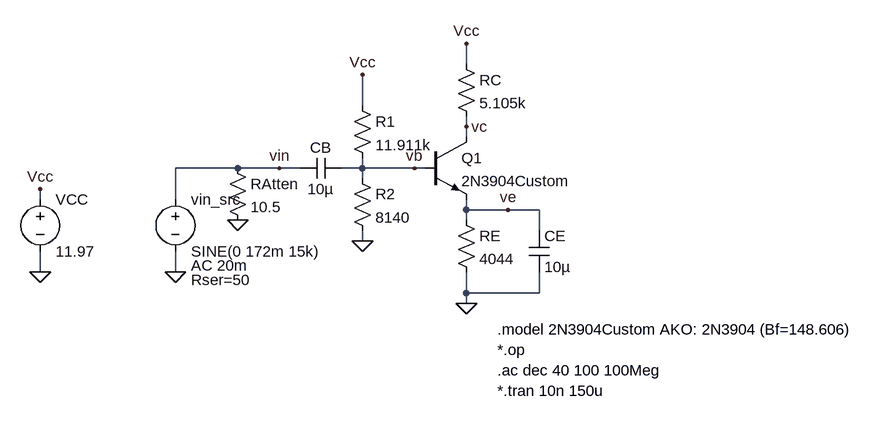
[diagram p0: schematic lab4_real.asc]
lab4_real.asc, the LTspice schematic file:
Version 4
SHEET 1 1144 680
WIRE 528 64 528 32
WIRE 368 128 368 80
WIRE 528 160 528 144
WIRE 528 176 528 160
WIRE 176 224 80 224
WIRE 240 224 176 224
WIRE 272 224 240 224
WIRE 368 224 368 208
WIRE 368 224 336 224
WIRE 448 224 368 224
WIRE 464 224 448 224
WIRE 368 240 368 224
WIRE -128 272 -128 256
WIRE 80 272 80 224
WIRE 528 288 528 272
WIRE 592 288 528 288
WIRE 640 288 592 288
WIRE 528 304 528 288
WIRE 640 320 640 288
WIRE 368 336 368 320
WIRE -128 384 -128 352
WIRE 80 384 80 352
WIRE 528 416 528 384
WIRE 640 416 640 384
WIRE 640 416 528 416
WIRE 528 432 528 416
FLAG 80 384 0
FLAG 528 432 0
FLAG 368 336 0
FLAG -128 384 0
FLAG 240 224 vin
FLAG 592 288 ve
FLAG 448 224 vb
FLAG 528 160 vc
FLAG 176 304 0
FLAG -128 256 Vcc
FLAG 528 32 Vcc
FLAG 368 80 Vcc
SYMBOL Res 352 112 R0
SYMATTR InstName R1
SYMATTR Value 11.911k
SYMBOL Res 352 224 R0
SYMATTR InstName R2
SYMATTR Value 8140
SYMBOL Cap 336 208 R90
WINDOW 0 0 32 VBottom 2
WINDOW 3 32 32 VTop 2
SYMATTR InstName CB
SYMATTR Value 10µ
SYMBOL Res 512 48 R0
SYMATTR InstName RC
SYMATTR Value 5.105k
SYMBOL Res 512 288 R0
SYMATTR InstName RE
SYMATTR Value 4044
SYMBOL Cap 624 320 R0
SYMATTR InstName CE
SYMATTR Value 10µ
SYMBOL Voltage 80 256 R0
WINDOW 123 24 118 Left 2
WINDOW 39 24 140 Left 2
SYMATTR Value2 AC 20m
SYMATTR SpiceLine Rser=50
SYMATTR InstName vin_src
SYMATTR Value SINE(0 172m 15k)
SYMBOL npn 464 176 R0
SYMATTR InstName Q1
SYMATTR Value 2N3904Custom
SYMBOL Voltage -128 256 R0
SYMATTR InstName VCC
SYMATTR Value 11.97
SYMBOL Res 160 208 R0
SYMATTR InstName RAtten
SYMATTR Value 10.5
TEXT 576 472 Left 2 !.model 2N3904Custom AKO: 2N3904 (Bf=148.606)
TEXT 576 504 Left 2 !*.op\n.ac dec 40 100 100Meg\n*.tran 10n 150u

The netlist it stands for:
* lab4_real.asc
R1 Vcc vb 11.911k
R2 vb 0 8140
CB vb vin 10µ
RC Vcc vc 5.105k
RE ve 0 4044
CE ve 0 10µ
vin_src vin 0 SINE(0 172m 15k) AC 20m Rser=50
Q1 vc vb ve 0 2N3904Custom
VCC Vcc 0 11.97
RAtten vin 0 10.5
.model NPN NPN
.model PNP PNP
.lib standard.bjt
.model 2N3904Custom AKO: 2N3904 (Bf=148.606)
*.op
.ac dec 40 100 100Meg
*.tran 10n 150u
.backanno
.end

* Results of the author's LTspice run, read from the files saved beside the schematic
* Operating Point, zero values left out:
*   V(vcc) = 11.97 V
*   V(vb) = 4.827 V
*   V(vc) = 6.739 V
*   V(ve) = 4.171 V
*   Ic(Q1) = 1.025 mA
*   Ib(Q1) = 6.782 µA
*   Ie(Q1) = -1.031 mA
*   I(R1) = 599.7 µA
*   I(R2) = 592.9 µA
*   I(Rc) = 1.025 mA
*   I(Re) = 1.031 mA
*   I(Vcc) = -1.624 mA
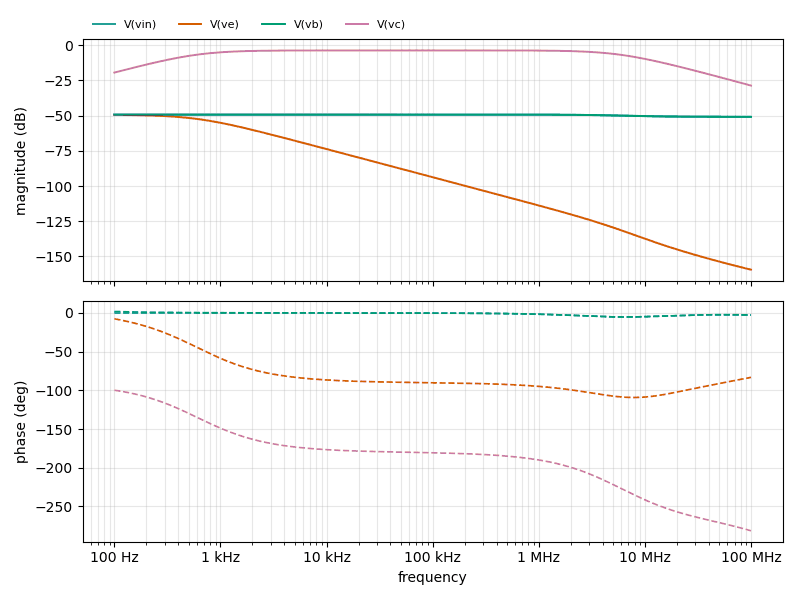
[diagram p1: AC Analysis of lab4_real.asc, plotted from the saved traces]
* AC Analysis, 1 run:
*   V(vin): -49.21 dB at 100 Hz, -50.83 dB at 100 MHz, peak -49.21 dB at 100 Hz
*   V(ve): -49.45 dB at 100 Hz, -159.39 dB at 100 MHz, peak -49.45 dB at 100 Hz, 3 dB below the peak at 621.6 Hz
*   V(vb): -49.27 dB at 100 Hz, -50.83 dB at 100 MHz, peak -49.23 dB at 25.12 kHz
*   V(vc): -19.38 dB at 100 Hz, -28.62 dB at 100 MHz, peak -3.63 dB at 59.57 kHz, 3 dB below the peak at 604.9 Hz and 5.767 MHz